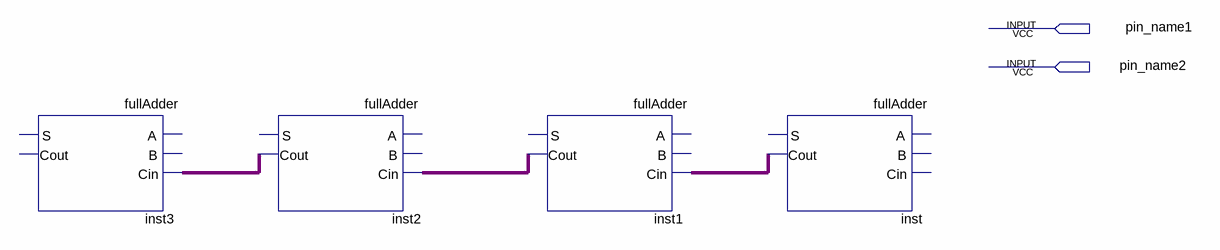
[diagram p0: schematic sheet]
// Quartus schematic aluComponent.bdf as structural Verilog: 4 symbols, 2 pins
module aluComponent (
  input  pin_name1,
  input  pin_name2
);

  wire inst1_cout, inst2_cout, inst_cout;

  fullAdder inst3 (.Cin(inst2_cout));  // open: A, B, S, Cout
  fullAdder inst2 (.Cin(inst1_cout), .Cout(inst2_cout));  // open: A, B, S
  fullAdder inst1 (.Cin(inst_cout), .Cout(inst1_cout));  // open: A, B, S
  fullAdder inst (.Cout(inst_cout));  // open: A, B, Cin, S
endmodule
